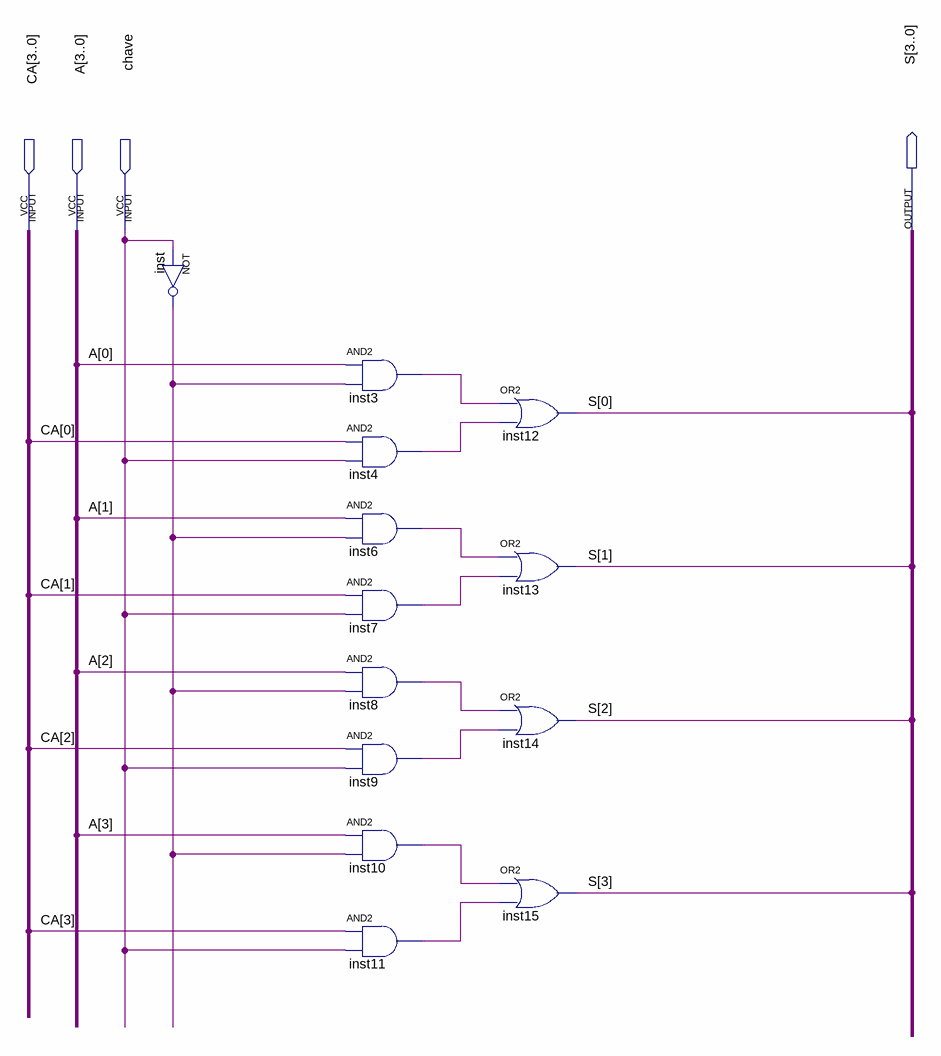
[diagram p0: schematic sheet]
// Quartus schematic mux2x1.bdf as structural Verilog: 13 symbols, 4 pins
module mux2x1 (
  input  [3:0] CA,
  input  [3:0] A,
  input  chave,
  output [3:0] S
);

  wire inst3_out, inst4_out, inst6_out, inst7_out, inst8_out, inst9_out, inst10_out, inst11_out, inst_out;

  not inst (inst_out, chave);
  and inst3 (inst3_out, A[0], inst_out);
  and inst4 (inst4_out, CA[0], chave);
  and inst6 (inst6_out, A[1], inst_out);
  and inst7 (inst7_out, CA[1], chave);
  and inst8 (inst8_out, A[2], inst_out);
  and inst9 (inst9_out, CA[2], chave);
  and inst10 (inst10_out, A[3], inst_out);
  and inst11 (inst11_out, CA[3], chave);
  or inst12 (S[0], inst3_out, inst4_out);
  or inst13 (S[1], inst6_out, inst7_out);
  or inst14 (S[2], inst8_out, inst9_out);
  or inst15 (S[3], inst10_out, inst11_out);
endmodule
